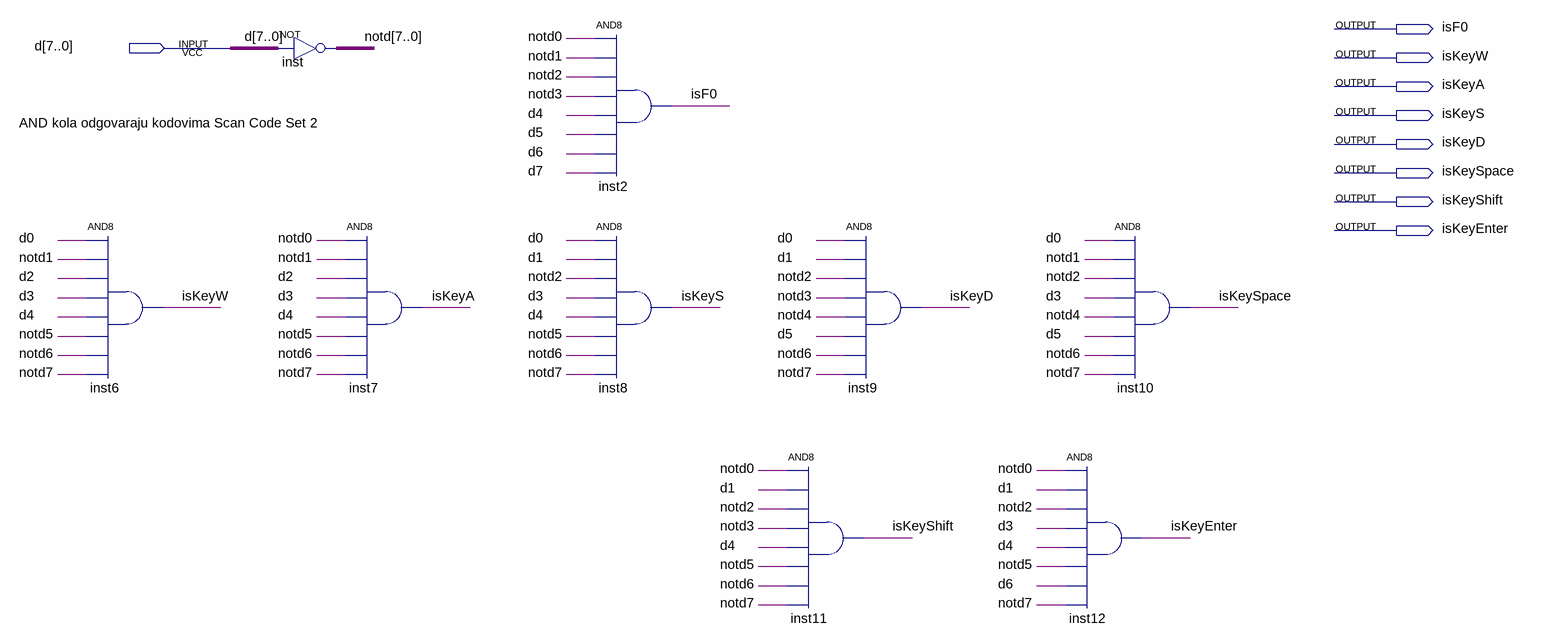
[diagram p0: schematic sheet]
// Quartus schematic KeyDetector_WASD.bdf as structural Verilog: 9 symbols, 9 pins
module KeyDetector_WASD (
  input  [7:0] d,
  output isF0,
  output isKeyW,
  output isKeyA,
  output isKeyS,
  output isKeyD,
  output isKeySpace,
  output isKeyShift,
  output isKeyEnter
);

  wire [7:0] notd;

  and inst6 (isKeyW, d[0], notd[1], d[2], d[3], d[4], notd[5], notd[6], notd[7]);
  assign notd = ~d;  // NOT inst, 8 bits wide
  and inst7 (isKeyA, notd[0], notd[1], d[2], d[3], d[4], notd[5], notd[6], notd[7]);
  and inst2 (isF0, notd[0], notd[1], notd[2], notd[3], d[4], d[5], d[6], d[7]);
  and inst8 (isKeyS, d[0], d[1], notd[2], d[3], d[4], notd[5], notd[6], notd[7]);
  and inst11 (isKeyShift, notd[0], d[1], notd[2], notd[3], d[4], notd[5], notd[6], notd[7]);
  and inst9 (isKeyD, d[0], d[1], notd[2], notd[3], notd[4], d[5], notd[6], notd[7]);
  and inst12 (isKeyEnter, notd[0], d[1], notd[2], d[3], d[4], notd[5], d[6], notd[7]);
  and inst10 (isKeySpace, d[0], notd[1], notd[2], d[3], notd[4], d[5], notd[6], notd[7]);

  // Notes on the sheet:
  //   AND kola odgovaraju kodovima Scan Code Set 2
endmodule
